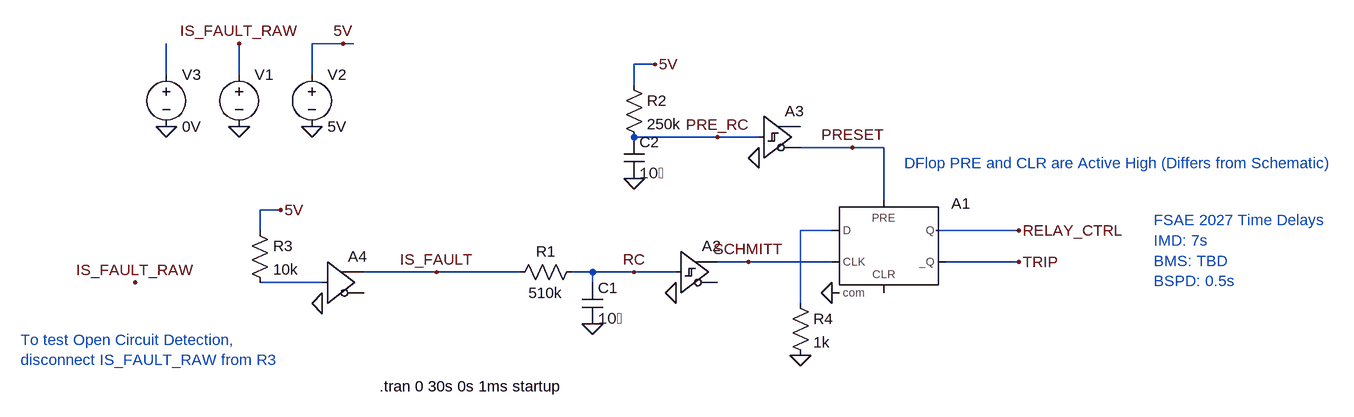
[diagram p0: schematic SDC_Latch.asc]
SDC_Latch.asc, the LTspice schematic file:
Version 4
SHEET 1 988 708
WIRE -576 -144 -624 -144
WIRE -560 -144 -576 -144
WIRE -96 -112 -128 -112
WIRE -848 -96 -848 -144
WIRE -736 -96 -736 -144
WIRE -624 -96 -624 -144
WIRE -128 -80 -128 -112
WIRE 0 0 -128 0
WIRE 64 0 0 0
WIRE 208 16 128 16
WIRE 256 16 208 16
WIRE 256 96 256 16
WIRE -672 112 -704 112
WIRE -704 144 -704 112
WIRE 176 144 128 144
WIRE 464 144 336 144
WIRE 48 192 0 192
WIRE 176 192 48 192
WIRE 464 192 352 192
WIRE -432 208 -544 208
WIRE -304 208 -432 208
WIRE -192 208 -224 208
WIRE -128 208 -192 208
WIRE -64 208 -128 208
WIRE -608 224 -704 224
WIRE -192 224 -192 208
WIRE 128 256 128 144
FLAG 464 192 TRIP
FLAG 464 144 RELAY_CTRL
FLAG 208 16 PRESET
FLAG 48 192 SCHMITT
FLAG -192 288 0
FLAG -128 208 RC
FLAG -128 64 0
FLAG -96 -112 5V
FLAG -432 208 IS_FAULT
FLAG -672 112 5V
FLAG -896 224 IS_FAULT_RAW
FLAG -576 -144 5V
FLAG -736 -144 IS_FAULT_RAW
FLAG -736 -16 0
FLAG -624 -16 0
FLAG 64 32 0
FLAG -64 240 0
FLAG -608 256 0
FLAG 128 336 0
FLAG 176 240 0
FLAG -848 -16 0
FLAG 0 0 PRE_RC
SYMBOL Digital\\dflop 256 96 R0
WINDOW 3 8 40 Invisible 2
SYMATTR Value Vt=2.5
SYMATTR InstName A1
SYMATTR Value2 Vhigh=5 Vlow=0 Ref=2.5
SYMBOL Digital\\schmitt -64 144 R0
WINDOW 3 22 101 Invisible 2
SYMATTR Value Vt = 2.5
SYMATTR InstName A2
SYMATTR Value2 Vh = 1.1, Vhigh = 5, Vlow = 0
SYMBOL Digital\\schmitt 64 -64 R0
WINDOW 3 8 120 Invisible 2
SYMATTR Value Vt=2.5
SYMATTR InstName A3
SYMATTR Value2 Vh = 1.1, Vhigh=5, Vlow = 0
SYMBOL cap -208 224 R0
SYMATTR InstName C1
SYMATTR Value 10�
SYMBOL res -208 192 R90
WINDOW 0 0 56 VBottom 2
WINDOW 3 32 56 VTop 2
SYMATTR InstName R1
SYMATTR Value 510k
SYMBOL res -144 -96 R0
SYMATTR InstName R2
SYMATTR Value 250k
SYMBOL cap -144 0 R0
SYMATTR InstName C2
SYMATTR Value 10�
SYMBOL Digital\\buf -608 160 R0
WINDOW 3 8 44 Invisible 2
SYMATTR Value Vt = 2.5
SYMATTR InstName A4
SYMATTR Value2 Vhigh = 5, Vlow = 0
SYMBOL res -720 128 R0
SYMATTR InstName R3
SYMATTR Value 10k
SYMBOL voltage -736 -112 R0
WINDOW 3 24 96 Invisible 2
WINDOW 123 0 0 Left 0
WINDOW 39 0 0 Left 0
SYMATTR Value PULSE(0 5 3 1p 1p 8 15 2)
SYMATTR InstName V1
SYMBOL voltage -624 -112 R0
WINDOW 123 0 0 Left 0
WINDOW 39 0 0 Left 0
SYMATTR InstName V2
SYMATTR Value 5V
SYMBOL res 112 240 R0
SYMATTR InstName R4
SYMATTR Value 1k
SYMBOL voltage -848 -112 R0
WINDOW 123 0 0 Left 0
WINDOW 39 0 0 Left 0
SYMATTR InstName V3
SYMATTR Value 0V
TEXT -520 384 Left 2 !.tran 0 30s 0s 1ms startup
TEXT -1072 312 Left 2 ;To test Open Circuit Detection, \ndisconnect IS_FAULT_RAW from R3
TEXT 288 40 Left 2 ;DFlop PRE and CLR are Active High (Differs from Schematic)
TEXT 672 128 Left 2 ;FSAE 2027 Time Delays\nIMD: 7s\nBMS: TBD\nBSPD: 0.5s

The netlist it stands for:
* SDC_Latch.asc
A1 N002 0 SCHMITT PRESET 0 TRIP RELAY_CTRL 0 DFLOP Vt=2.5 Vhigh=5 Vlow=0 Ref=2.5
A2 RC 0 0 0 0 0 SCHMITT 0 SCHMITT Vt = 2.5 Vh = 1.1, Vhigh = 5, Vlow = 0
A3 PRE_RC 0 0 0 0 PRESET 0 0 SCHMITT Vt=2.5 Vh = 1.1, Vhigh=5, Vlow = 0
C1 RC 0 10�
R1 RC IS_FAULT 510k
R2 5V PRE_RC 250k
C2 PRE_RC 0 10�
A4 N003 0 0 0 0 0 IS_FAULT 0 BUF Vt = 2.5 Vhigh = 5, Vlow = 0
R3 5V N003 10k
V1 IS_FAULT_RAW 0 PULSE(0 5 3 1p 1p 8 15 2)
V2 5V 0 5V
R4 N002 0 1k
V3 N001 0 0V
.tran 0 30s 0s 1ms startup
* To test Open Circuit Detection,
* disconnect IS_FAULT_RAW from R3
* DFlop PRE and CLR are Active High (Differs from Schematic)
* FSAE 2027 Time Delays
* IMD: 7s
* BMS: TBD
* BSPD: 0.5s
.backanno
.end